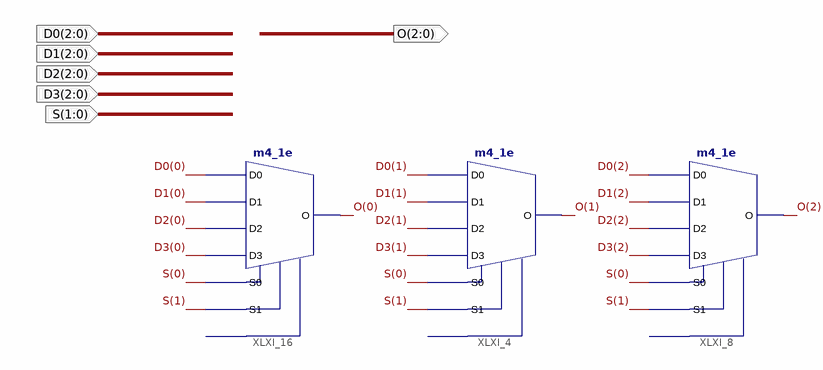
[diagram p0: schematic sheet 1]
// Xilinx ISE schematic mux4to1_3bit.sch (spartan6) as structural Verilog: 3 symbols, 6 ports
module mux4to1_3bit (
  input  [2:0] D0,
  input  [2:0] D1,
  input  [2:0] D2,
  input  [2:0] D3,
  input  [1:0] S,
  output [2:0] O
);

  m4_1e XLXI_4 (.D0(D0[1]), .D1(D1[1]), .D2(D2[1]), .D3(D3[1]), .S0(S[0]), .S1(S[1]), .O(O[1]));  // open: E
  m4_1e XLXI_8 (.D0(D0[2]), .D1(D1[2]), .D2(D2[2]), .D3(D3[2]), .S0(S[0]), .S1(S[1]), .O(O[2]));  // open: E
  m4_1e XLXI_16 (.D0(D0[0]), .D1(D1[0]), .D2(D2[0]), .D3(D3[0]), .S0(S[0]), .S1(S[1]), .O(O[0]));  // open: E
endmodule
